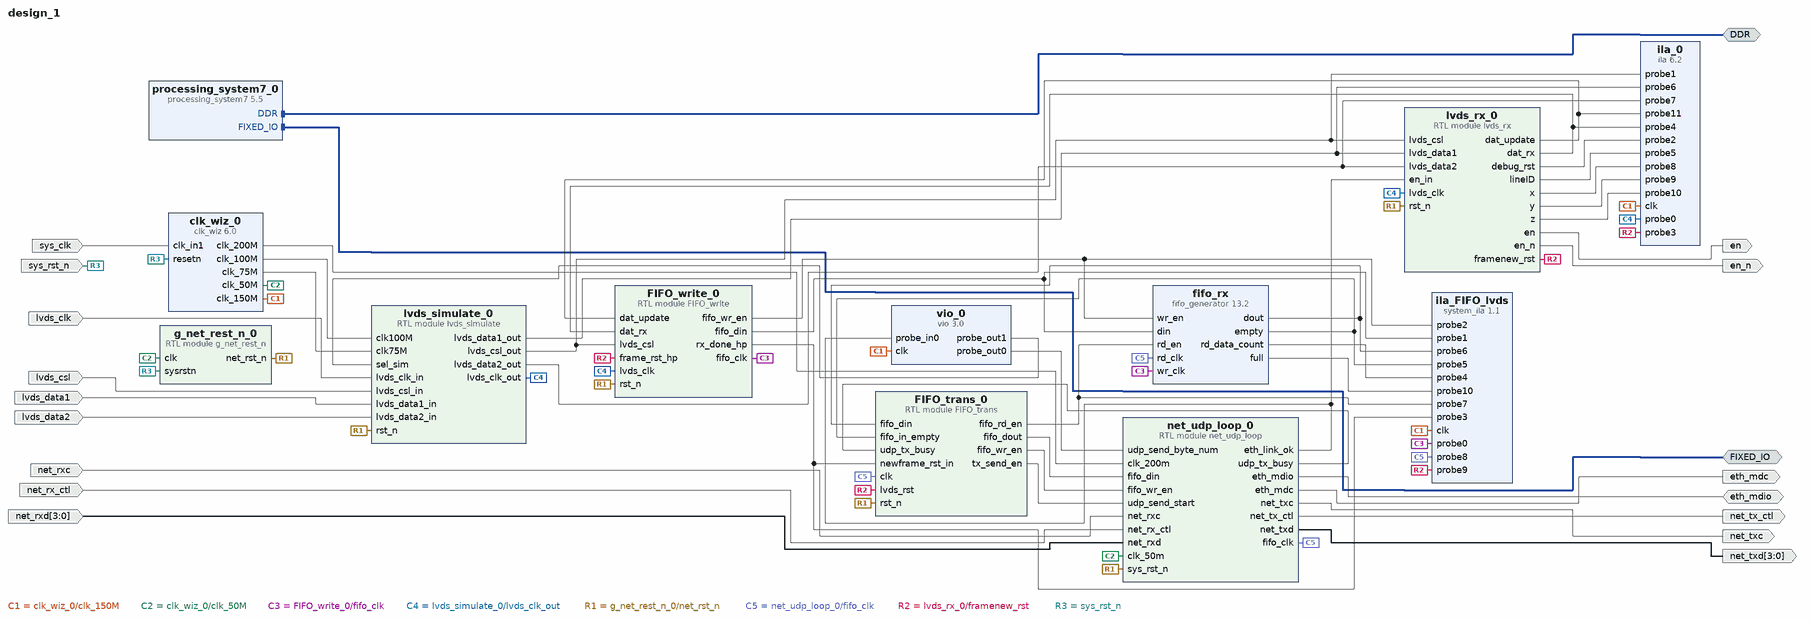
[diagram p0: block diagram of the top level]
# Vivado block design design_1, xc7z010clg400-2, Vivado 2020.2
create_bd_design design_1

create_bd_intf_port -mode Master -vlnv xilinx.com:interface:ddrx_rtl:1.0 DDR
create_bd_intf_port -mode Master -vlnv xilinx.com:display_processing_system7:fixedio_rtl:1.0 FIXED_IO
create_bd_port -dir I -type clk sys_clk
set_property -dict {CONFIG.FREQ_HZ 50000000} [get_bd_ports sys_clk]
create_bd_port -dir I -type rst sys_rst_n
set_property -dict {CONFIG.POLARITY ACTIVE_LOW} [get_bd_ports sys_rst_n]
create_bd_port -dir I -type clk lvds_clk
create_bd_port -dir I lvds_csl
create_bd_port -dir I lvds_data1
create_bd_port -dir I lvds_data2
create_bd_port -dir O en
create_bd_port -dir O en_n
create_bd_port -dir IO eth_mdio
create_bd_port -dir O eth_mdc
create_bd_port -dir O net_txc
create_bd_port -dir O net_tx_ctl
create_bd_port -dir O -from 3 -to 0 net_txd
create_bd_port -dir I net_rxc
create_bd_port -dir I net_rx_ctl
create_bd_port -dir I -from 3 -to 0 net_rxd

create_bd_cell -type ip -vlnv xilinx.com:ip:processing_system7:5.5 processing_system7_0
set_property -dict [list \
  CONFIG.PCW_ENET0_PERIPHERAL_CLKSRC External \
  CONFIG.PCW_ENET0_PERIPHERAL_ENABLE 0 \
  CONFIG.PCW_EN_CLK0_PORT 0 \
  CONFIG.PCW_EN_RST0_PORT 0 \
  CONFIG.PCW_PRESET_BANK1_VOLTAGE {LVCMOS 1.8V} \
  CONFIG.PCW_QSPI_GRP_SINGLE_SS_ENABLE 1 \
  CONFIG.PCW_QSPI_GRP_SINGLE_SS_IO {MIO 1 .. 6} \
  CONFIG.PCW_QSPI_PERIPHERAL_ENABLE 1 \
  CONFIG.PCW_QSPI_QSPI_IO {MIO 1 .. 6} \
  CONFIG.PCW_SD0_GRP_CD_ENABLE 0 \
  CONFIG.PCW_SD0_GRP_WP_ENABLE 0 \
  CONFIG.PCW_SD0_PERIPHERAL_ENABLE 1 \
  CONFIG.PCW_SD0_SD0_IO {MIO 40 .. 45} \
  CONFIG.PCW_SDIO_PERIPHERAL_FREQMHZ 100 \
  CONFIG.PCW_SINGLE_QSPI_DATA_MODE x4 \
  CONFIG.PCW_UART0_PERIPHERAL_ENABLE 1 \
  CONFIG.PCW_UART0_UART0_IO {MIO 10 .. 11} \
  CONFIG.PCW_UART1_PERIPHERAL_ENABLE 0 \
  CONFIG.PCW_UART_PERIPHERAL_FREQMHZ 100 \
  CONFIG.PCW_UIPARAM_DDR_BUS_WIDTH {16 Bit} \
  CONFIG.PCW_UIPARAM_DDR_PARTNO {MT41K256M16 RE-125} \
  CONFIG.PCW_USE_M_AXI_GP0 0 \
] [get_bd_cells processing_system7_0]
# 90 more settings of processing_system7_0 are not shown: defaults, MIO pin electricals, DDR timing, and values the tool derives
create_bd_cell -type module -reference lvds_rx lvds_rx_0
create_bd_cell -type module -reference g_net_rest_n g_net_rest_n_0
create_bd_cell -type ip -vlnv xilinx.com:ip:vio:3.0 vio_0
set_property -dict [list \
  CONFIG.C_EN_PROBE_IN_ACTIVITY 0 \
  CONFIG.C_NUM_PROBE_IN 1 \
  CONFIG.C_NUM_PROBE_OUT 2 \
  CONFIG.C_PROBE_OUT0_INIT_VAL 0x045A \
  CONFIG.C_PROBE_OUT0_WIDTH 16 \
  CONFIG.C_PROBE_OUT1_INIT_VAL 0000 \
] [get_bd_cells vio_0]
create_bd_cell -type ip -vlnv xilinx.com:ip:clk_wiz:6.0 clk_wiz_0
set_property -dict [list \
  CONFIG.CLKIN1_JITTER_PS 200.0 \
  CONFIG.CLKOUT1_JITTER 129.923 \
  CONFIG.CLKOUT1_PHASE_ERROR 154.678 \
  CONFIG.CLKOUT1_REQUESTED_OUT_FREQ 150 \
  CONFIG.CLKOUT2_JITTER 124.134 \
  CONFIG.CLKOUT2_PHASE_ERROR 154.678 \
  CONFIG.CLKOUT2_REQUESTED_OUT_FREQ 200.000 \
  CONFIG.CLKOUT2_USED true \
  CONFIG.CLKOUT3_JITTER 163.696 \
  CONFIG.CLKOUT3_PHASE_ERROR 154.678 \
  CONFIG.CLKOUT3_REQUESTED_OUT_FREQ 50.000 \
  CONFIG.CLKOUT3_USED true \
  CONFIG.CLKOUT4_JITTER 139.128 \
  CONFIG.CLKOUT4_PHASE_ERROR 154.678 \
  CONFIG.CLKOUT4_USED true \
  CONFIG.CLKOUT5_JITTER 148.365 \
  CONFIG.CLKOUT5_PHASE_ERROR 154.678 \
  CONFIG.CLKOUT5_REQUESTED_OUT_FREQ 75 \
  CONFIG.CLKOUT5_USED true \
  CONFIG.CLK_OUT1_PORT clk_150M \
  CONFIG.CLK_OUT2_PORT clk_200M \
  CONFIG.CLK_OUT3_PORT clk_50M \
  CONFIG.CLK_OUT4_PORT clk_100M \
  CONFIG.CLK_OUT5_PORT clk_75M \
  CONFIG.MMCM_CLKFBOUT_MULT_F 24.000 \
  CONFIG.MMCM_CLKIN1_PERIOD 20.000 \
  CONFIG.MMCM_CLKIN2_PERIOD 10.0 \
  CONFIG.MMCM_CLKOUT0_DIVIDE_F 8.000 \
  CONFIG.MMCM_CLKOUT1_DIVIDE 6 \
  CONFIG.MMCM_CLKOUT2_DIVIDE 24 \
  CONFIG.MMCM_CLKOUT3_DIVIDE 12 \
  CONFIG.MMCM_CLKOUT4_DIVIDE 16 \
  CONFIG.MMCM_DIVCLK_DIVIDE 1 \
  CONFIG.NUM_OUT_CLKS 5 \
  CONFIG.PRIM_IN_FREQ 50.000 \
  CONFIG.RESET_PORT resetn \
  CONFIG.RESET_TYPE ACTIVE_LOW \
] [get_bd_cells clk_wiz_0]
create_bd_cell -type ip -vlnv xilinx.com:ip:fifo_generator:13.2 fifo_rx
set_property -dict [list \
  CONFIG.Almost_Full_Flag false \
  CONFIG.Fifo_Implementation Independent_Clocks_Block_RAM \
  CONFIG.INTERFACE_TYPE Native \
  CONFIG.Input_Data_Width 16 \
  CONFIG.Input_Depth 8192 \
  CONFIG.Output_Data_Width 16 \
  CONFIG.Performance_Options Standard_FIFO \
  CONFIG.Read_Data_Count true \
  CONFIG.Read_Data_Count_Width 13 \
  CONFIG.Reset_Pin false \
  CONFIG.Write_Data_Count false \
] [get_bd_cells fifo_rx]
create_bd_cell -type ip -vlnv xilinx.com:ip:ila:6.2 ila_0
set_property -dict [list \
  CONFIG.ALL_PROBE_SAME_MU_CNT 2 \
  CONFIG.C_DATA_DEPTH 4096 \
  CONFIG.C_ENABLE_ILA_AXI_MON false \
  CONFIG.C_EN_STRG_QUAL 1 \
  CONFIG.C_MONITOR_TYPE Native \
  CONFIG.C_NUM_OF_PROBES 12 \
  CONFIG.C_PROBE0_MU_CNT 2 \
  CONFIG.C_PROBE10_MU_CNT 2 \
  CONFIG.C_PROBE10_WIDTH 16 \
  CONFIG.C_PROBE11_MU_CNT 2 \
  CONFIG.C_PROBE1_MU_CNT 2 \
  CONFIG.C_PROBE2_MU_CNT 2 \
  CONFIG.C_PROBE3_MU_CNT 2 \
  CONFIG.C_PROBE4_MU_CNT 2 \
  CONFIG.C_PROBE4_WIDTH 16 \
  CONFIG.C_PROBE5_MU_CNT 2 \
  CONFIG.C_PROBE5_WIDTH 8 \
  CONFIG.C_PROBE6_MU_CNT 2 \
  CONFIG.C_PROBE6_WIDTH 1 \
  CONFIG.C_PROBE7_MU_CNT 2 \
  CONFIG.C_PROBE7_WIDTH 1 \
  CONFIG.C_PROBE8_MU_CNT 2 \
  CONFIG.C_PROBE8_WIDTH 16 \
  CONFIG.C_PROBE9_MU_CNT 2 \
  CONFIG.C_PROBE9_WIDTH 16 \
] [get_bd_cells ila_0]
create_bd_cell -type ip -vlnv xilinx.com:ip:system_ila:1.1 ila_FIFO_lvds
set_property -dict [list \
  CONFIG.ALL_PROBE_SAME_MU_CNT 2 \
  CONFIG.C_DATA_DEPTH 4096 \
  CONFIG.C_EN_STRG_QUAL 1 \
  CONFIG.C_MON_TYPE NATIVE \
  CONFIG.C_NUM_OF_PROBES 11 \
  CONFIG.C_PROBE0_MU_CNT 2 \
  CONFIG.C_PROBE10_MU_CNT 2 \
  CONFIG.C_PROBE11_MU_CNT 2 \
  CONFIG.C_PROBE12_MU_CNT 2 \
  CONFIG.C_PROBE1_MU_CNT 2 \
  CONFIG.C_PROBE1_WIDTH 16 \
  CONFIG.C_PROBE2_MU_CNT 2 \
  CONFIG.C_PROBE3_MU_CNT 2 \
  CONFIG.C_PROBE4_MU_CNT 2 \
  CONFIG.C_PROBE4_WIDTH 13 \
  CONFIG.C_PROBE5_MU_CNT 2 \
  CONFIG.C_PROBE5_WIDTH 1 \
  CONFIG.C_PROBE6_MU_CNT 2 \
  CONFIG.C_PROBE6_WIDTH 16 \
  CONFIG.C_PROBE7_MU_CNT 2 \
  CONFIG.C_PROBE8_MU_CNT 2 \
  CONFIG.C_PROBE9_MU_CNT 2 \
  CONFIG.C_PROBE_WIDTH_PROPAGATION MANUAL \
] [get_bd_cells ila_FIFO_lvds]
create_bd_cell -type module -reference FIFO_trans FIFO_trans_0
create_bd_cell -type module -reference net_udp_loop net_udp_loop_0
create_bd_cell -type module -reference FIFO_write FIFO_write_0
create_bd_cell -type module -reference lvds_simulate lvds_simulate_0

# ---- connections ----

connect_bd_intf_net [get_bd_intf_ports DDR] [get_bd_intf_pins processing_system7_0/DDR]
connect_bd_intf_net [get_bd_intf_ports FIXED_IO] [get_bd_intf_pins processing_system7_0/FIXED_IO]
connect_bd_net [get_bd_ports sys_clk] [get_bd_pins clk_wiz_0/clk_in1]
connect_bd_net [get_bd_pins clk_wiz_0/clk_150M] [get_bd_pins vio_0/clk] [get_bd_pins ila_0/clk] [get_bd_pins ila_FIFO_lvds/clk]
connect_bd_net [get_bd_pins lvds_rx_0/dat_update] [get_bd_pins ila_0/probe11] [get_bd_pins FIFO_write_0/dat_update]
connect_bd_net [get_bd_pins lvds_rx_0/dat_rx] [get_bd_pins ila_0/probe4] [get_bd_pins FIFO_write_0/dat_rx]
connect_bd_net [get_bd_pins lvds_rx_0/en] [get_bd_ports en]
connect_bd_net [get_bd_pins lvds_rx_0/en_n] [get_bd_ports en_n]
connect_bd_net [get_bd_pins clk_wiz_0/clk_50M] [get_bd_pins g_net_rest_n_0/clk] [get_bd_pins net_udp_loop_0/clk_50m]
connect_bd_net [get_bd_ports eth_mdio] [get_bd_pins net_udp_loop_0/eth_mdio]
connect_bd_net [get_bd_pins net_udp_loop_0/eth_mdc] [get_bd_ports eth_mdc]
connect_bd_net [get_bd_pins net_udp_loop_0/net_txc] [get_bd_ports net_txc]
connect_bd_net [get_bd_pins net_udp_loop_0/net_tx_ctl] [get_bd_ports net_tx_ctl]
connect_bd_net [get_bd_pins net_udp_loop_0/net_txd] [get_bd_ports net_txd]
connect_bd_net -net net_rxc_0_1 [get_bd_ports net_rxc] [get_bd_pins net_udp_loop_0/net_rxc]
connect_bd_net -net net_rx_ctl_0_1 [get_bd_ports net_rx_ctl] [get_bd_pins net_udp_loop_0/net_rx_ctl]
connect_bd_net -net net_rxd_0_1 [get_bd_ports net_rxd] [get_bd_pins net_udp_loop_0/net_rxd]
connect_bd_net [get_bd_pins FIFO_write_0/fifo_clk] [get_bd_pins fifo_rx/wr_clk] [get_bd_pins ila_FIFO_lvds/probe0]
connect_bd_net [get_bd_pins fifo_rx/dout] [get_bd_pins ila_FIFO_lvds/probe6] [get_bd_pins FIFO_trans_0/fifo_din]
connect_bd_net [get_bd_pins fifo_rx/empty] [get_bd_pins ila_FIFO_lvds/probe5] [get_bd_pins FIFO_trans_0/fifo_in_empty]
connect_bd_net [get_bd_pins vio_0/probe_out0] [get_bd_pins net_udp_loop_0/udp_send_byte_num]
connect_bd_net [get_bd_pins clk_wiz_0/clk_100M] [get_bd_pins lvds_simulate_0/clk100M]
connect_bd_net [get_bd_pins clk_wiz_0/clk_75M] [get_bd_pins lvds_simulate_0/clk75M]
connect_bd_net [get_bd_pins vio_0/probe_out1] [get_bd_pins lvds_simulate_0/sel_sim]
connect_bd_net [get_bd_pins lvds_simulate_0/lvds_clk_out] \
  [get_bd_pins lvds_rx_0/lvds_clk] [get_bd_pins ila_0/probe0] [get_bd_pins FIFO_write_0/lvds_clk]
connect_bd_net [get_bd_pins lvds_simulate_0/lvds_csl_out] \
  [get_bd_pins lvds_rx_0/lvds_csl] [get_bd_pins ila_0/probe1] [get_bd_pins FIFO_write_0/lvds_csl]
connect_bd_net [get_bd_pins lvds_simulate_0/lvds_data1_out] [get_bd_pins lvds_rx_0/lvds_data1] [get_bd_pins ila_0/probe6]
connect_bd_net [get_bd_pins lvds_simulate_0/lvds_data2_out] [get_bd_pins lvds_rx_0/lvds_data2] [get_bd_pins ila_0/probe7]
connect_bd_net [get_bd_ports lvds_clk] [get_bd_pins lvds_simulate_0/lvds_clk_in]
connect_bd_net [get_bd_ports lvds_csl] [get_bd_pins lvds_simulate_0/lvds_csl_in]
connect_bd_net -net lvds_data1_1 [get_bd_ports lvds_data1] [get_bd_pins lvds_simulate_0/lvds_data1_in]
connect_bd_net -net lvds_data2_1 [get_bd_ports lvds_data2] [get_bd_pins lvds_simulate_0/lvds_data2_in]
connect_bd_net -net sys_rst_n_1 [get_bd_pins g_net_rest_n_0/net_rst_n] \
  [get_bd_pins lvds_rx_0/rst_n] [get_bd_pins FIFO_trans_0/rst_n] [get_bd_pins net_udp_loop_0/sys_rst_n] \
  [get_bd_pins FIFO_write_0/rst_n] [get_bd_pins lvds_simulate_0/rst_n]
connect_bd_net [get_bd_pins clk_wiz_0/clk_200M] [get_bd_pins net_udp_loop_0/clk_200m]
connect_bd_net [get_bd_pins lvds_rx_0/debug_rst] [get_bd_pins ila_0/probe2]
connect_bd_net [get_bd_pins lvds_rx_0/lineID] [get_bd_pins ila_0/probe5]
connect_bd_net [get_bd_pins net_udp_loop_0/fifo_clk] [get_bd_pins fifo_rx/rd_clk] [get_bd_pins ila_FIFO_lvds/probe8] [get_bd_pins FIFO_trans_0/clk]
connect_bd_net [get_bd_pins net_udp_loop_0/udp_tx_busy] [get_bd_pins FIFO_trans_0/udp_tx_busy]
connect_bd_net [get_bd_pins FIFO_trans_0/fifo_rd_en] [get_bd_pins fifo_rx/rd_en] [get_bd_pins ila_FIFO_lvds/probe7]
connect_bd_net [get_bd_pins FIFO_trans_0/fifo_dout] [get_bd_pins net_udp_loop_0/fifo_din]
connect_bd_net [get_bd_pins FIFO_trans_0/fifo_wr_en] [get_bd_pins net_udp_loop_0/fifo_wr_en]
connect_bd_net [get_bd_pins FIFO_trans_0/tx_send_en] [get_bd_pins net_udp_loop_0/udp_send_start]
connect_bd_net [get_bd_pins FIFO_write_0/fifo_wr_en] [get_bd_pins fifo_rx/wr_en] [get_bd_pins ila_FIFO_lvds/probe2]
connect_bd_net [get_bd_pins FIFO_write_0/fifo_din] [get_bd_pins fifo_rx/din] [get_bd_pins ila_FIFO_lvds/probe1]
connect_bd_net -net FIFO_write_0_rx_done [get_bd_pins FIFO_write_0/rx_done_hp] \
  [get_bd_pins ila_FIFO_lvds/probe3] [get_bd_pins FIFO_trans_0/newframe_rst_in]
connect_bd_net [get_bd_pins lvds_rx_0/framenew_rst] \
  [get_bd_pins ila_0/probe3] [get_bd_pins ila_FIFO_lvds/probe9] [get_bd_pins FIFO_trans_0/lvds_rst] \
  [get_bd_pins FIFO_write_0/frame_rst_hp]
connect_bd_net [get_bd_pins lvds_rx_0/x] [get_bd_pins ila_0/probe8]
connect_bd_net [get_bd_pins lvds_rx_0/y] [get_bd_pins ila_0/probe9]
connect_bd_net [get_bd_pins lvds_rx_0/z] [get_bd_pins ila_0/probe10]
connect_bd_net [get_bd_pins net_udp_loop_0/eth_link_ok] [get_bd_pins lvds_rx_0/en_in] [get_bd_pins vio_0/probe_in0]
connect_bd_net [get_bd_pins fifo_rx/rd_data_count] [get_bd_pins ila_FIFO_lvds/probe4]
connect_bd_net [get_bd_ports sys_rst_n] [get_bd_pins g_net_rest_n_0/sysrstn] [get_bd_pins clk_wiz_0/resetn]
connect_bd_net [get_bd_pins fifo_rx/full] [get_bd_pins ila_FIFO_lvds/probe10]

validate_bd_design
save_bd_design
